# EAGLE schematic shieldV0ben (EAGLE 8.7.1)

## Sheet 1 of 6
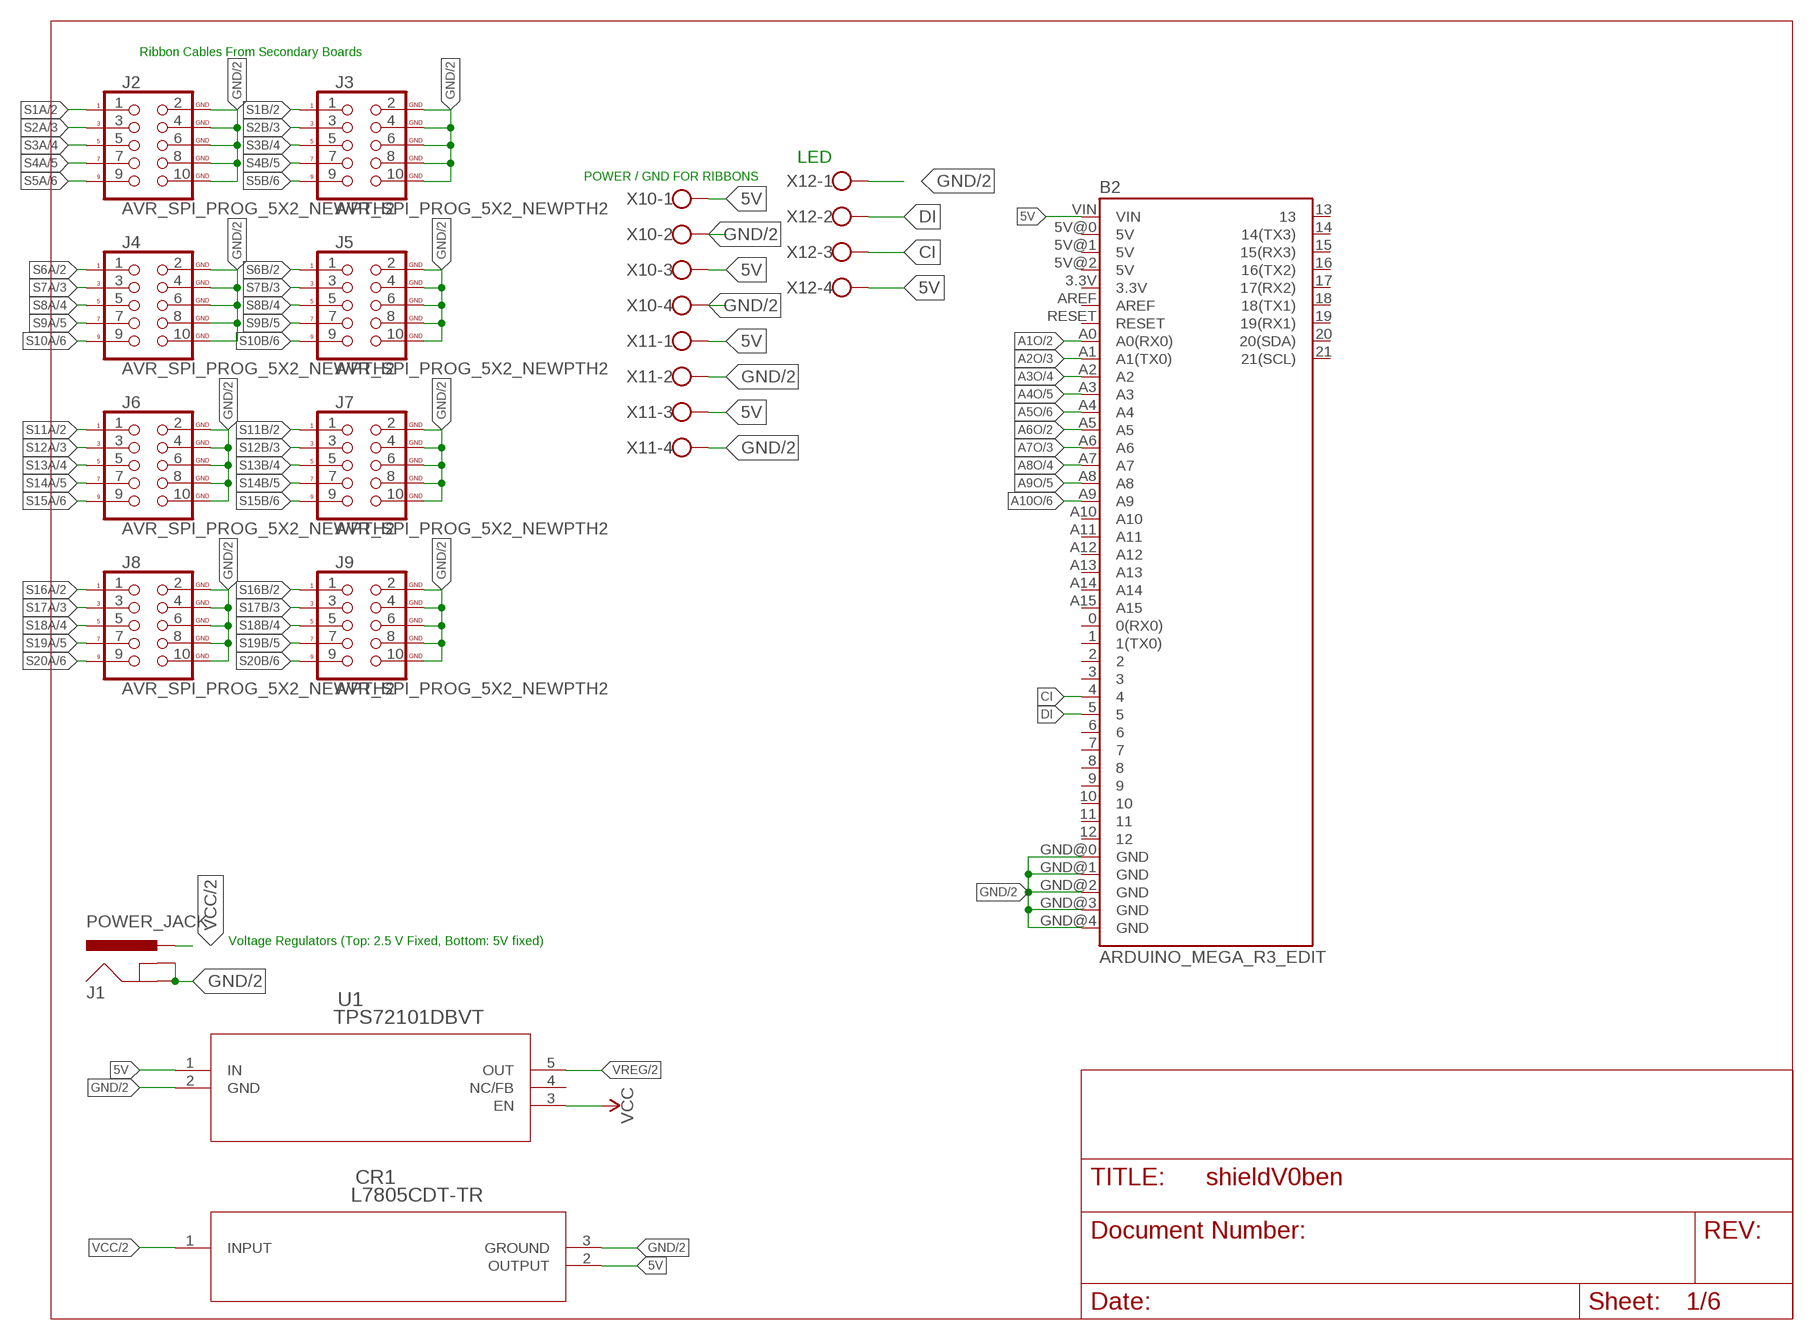
[diagram p0: schematic, sheet 1]

### Parts
B2  ARDUINO_MEGA_R3_EDIT  [ARDUINO_MEGA_EDIT]
CR1  L7805CDT-TR  [DPAK]
J1  POWER_JACK  [POWER_JACK_PTH]
J2  AVR_SPI_PROG_5X2_NEWPTH2  [2X5-SHROUDED]
J3  AVR_SPI_PROG_5X2_NEWPTH2  [2X5-SHROUDED]
J4  AVR_SPI_PROG_5X2_NEWPTH2  [2X5-SHROUDED]
J5  AVR_SPI_PROG_5X2_NEWPTH2  [2X5-SHROUDED]
J6  AVR_SPI_PROG_5X2_NEWPTH2  [2X5-SHROUDED]
J7  AVR_SPI_PROG_5X2_NEWPTH2  [2X5-SHROUDED]
J8  AVR_SPI_PROG_5X2_NEWPTH2  [2X5-SHROUDED]
J9  AVR_SPI_PROG_5X2_NEWPTH2  [2X5-SHROUDED]
U1  TPS72101DBVT  [DBV5]
X10  W237-4  [W237-4]
X11  W237-4  [W237-4]
X12  W237-4  [W237-4]

### Nets
5V: B2.VIN CR1.2(OUTPUT) U1.1(IN) X10.1 X10.3 X11.1 X11.3 X12.4
A1O: B2.A0(A0(RX0)) ; also sheet 2
A2O: B2.A1(A1(TX0)) ; also sheet 3
A3O: B2.A2 ; also sheet 4
A4O: B2.A3 ; also sheet 5
A5O: B2.A4 ; also sheet 6
A6O: B2.A5 ; also sheet 2
A7O: B2.A6 ; also sheet 3
A8O: B2.A7 ; also sheet 4
A9O: B2.A8 ; also sheet 5
A10O: B2.A9 ; also sheet 6
CI: B2.4 X12.3
DI: B2.5 X12.2
GND: B2.GND@0(GND) B2.GND@1(GND) B2.GND@2(GND) B2.GND@3(GND) B2.GND@4(GND) CR1.3(GROUND) J1.GND J1.GNDBREAK J2.2(GND) J2.4(GND) J2.6(GND) J2.8(GND) J2.10(GND) J3.2(GND) J3.4(GND) J3.6(GND) J3.8(GND) J3.10(GND) J4.2(GND) J4.4(GND) J4.6(GND) J4.8(GND) J4.10(GND) J5.2(GND) J5.4(GND) J5.6(GND) J5.8(GND) J5.10(GND) J6.2(GND) J6.4(GND) J6.6(GND) J6.8(GND) J6.10(GND) J7.2(GND) J7.4(GND) J7.6(GND) J7.8(GND) J7.10(GND) J8.2(GND) J8.4(GND) J8.6(GND) J8.8(GND) J8.10(GND) J9.2(GND) J9.4(GND) J9.6(GND) J9.8(GND) J9.10(GND) U1.2(GND) X10.2 X10.4 X11.2 X11.4 X12.1 ; also sheet 2,3,4,5,6
S1A: J2.1 ; also sheet 2
S1B: J3.1 ; also sheet 2
S2A: J2.3 ; also sheet 3
S2B: J3.3 ; also sheet 3
S3A: J2.5 ; also sheet 4
S3B: J3.5 ; also sheet 4
S4A: J2.7 ; also sheet 5
S4B: J3.7 ; also sheet 5
S5A: J2.9 ; also sheet 6
S5B: J3.9 ; also sheet 6
S6A: J4.1 ; also sheet 2
S6B: J5.1 ; also sheet 2
S7A: J4.3 ; also sheet 3
S7B: J5.3 ; also sheet 3
S8A: J4.5 ; also sheet 4
S8B: J5.5 ; also sheet 4
S9A: J4.7 ; also sheet 5
S9B: J5.7 ; also sheet 5
S10A: J4.9 ; also sheet 6
S10B: J5.9 ; also sheet 6
S11A: J6.1 ; also sheet 2
S11B: J7.1 ; also sheet 2
S12A: J6.3 ; also sheet 3
S12B: J7.3 ; also sheet 3
S13A: J6.5 ; also sheet 4
S13B: J7.5 ; also sheet 4
S14A: J6.7 ; also sheet 5
S14B: J7.7 ; also sheet 5
S15A: J6.9 ; also sheet 6
S15B: J7.9 ; also sheet 6
S16A: J8.1 ; also sheet 2
S16B: J9.1 ; also sheet 2
S17A: J8.3 ; also sheet 3
S17B: J9.3 ; also sheet 3
S18A: J8.5 ; also sheet 4
S18B: J9.5 ; also sheet 4
S19A: J8.7 ; also sheet 5
S19B: J9.7 ; also sheet 5
S20A: J8.9 ; also sheet 6
S20B: J9.9 ; also sheet 6
VCC: CR1.1(INPUT) J1.PWR U1.3(EN) ; also sheet 2,3,4,5,6
VREG: U1.5(OUT) ; also sheet 2,3,4,5,6
Unconnected: B2.0(0(RX0)) B2.1(1(TX0)) B2.2 B2.3 B2.3.3V B2.5V@0(5V) B2.5V@1(5V) B2.5V@2(5V) B2.6 B2.7 B2.8 B2.9 B2.10 B2.11 B2.12 B2.13 B2.14(14(TX3)) B2.15(15(RX3)) B2.16(16(TX2)) B2.17(17(RX2)) B2.18(18(TX1)) B2.19(19(RX1)) B2.20(20(SDA)) B2.21(21(SCL)) B2.A10 B2.A11 B2.A12 B2.A13 B2.A14 B2.A15 B2.AREF B2.RESET U1.4(NC/FB)

### Notes on the sheet
- Ribbon Cables From Secondary Boards
- LED
- POWER / GND FOR RIBBONS
- Voltage Regulators (Top: 2.5 V Fixed, Bottom: 5V fixed)

## Sheet 2 of 6
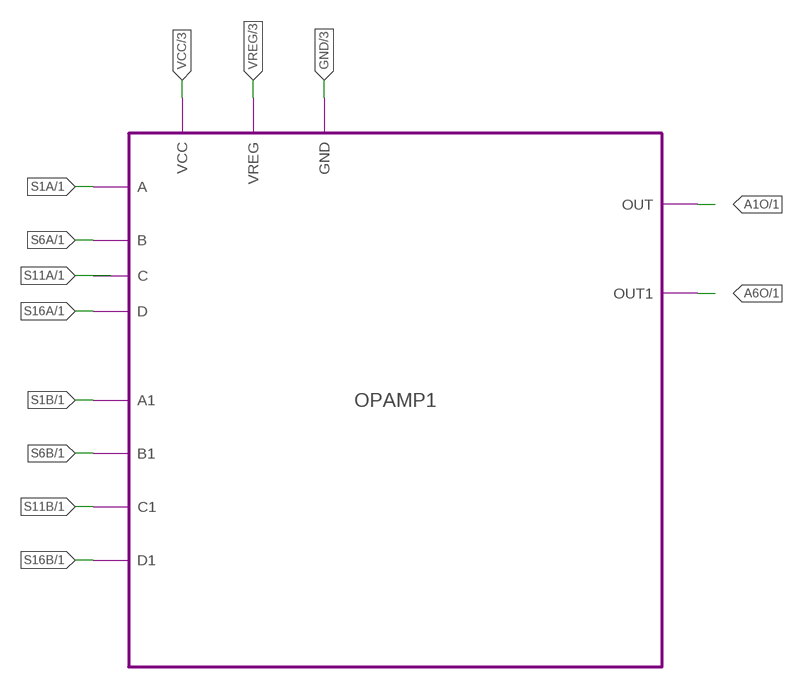
[diagram p1: schematic, sheet 2]

### Module instances
OPAMP1 = OPAMP

### Nets
A1O: port OPAMP1.OUT ; also sheet 1
A6O: port OPAMP1.OUT1 ; also sheet 1
GND: port OPAMP1.GND ; also sheet 1,3,4,5,6
S1A: port OPAMP1.A ; also sheet 1
S1B: port OPAMP1.A1 ; also sheet 1
S6A: port OPAMP1.B ; also sheet 1
S6B: port OPAMP1.B1 ; also sheet 1
S11B: port OPAMP1.C1 ; also sheet 1
S16A: port OPAMP1.D ; also sheet 1
S16B: port OPAMP1.D1 ; also sheet 1
VCC: port OPAMP1.VCC ; also sheet 1,3,4,5,6
VREG: port OPAMP1.VREG ; also sheet 1,3,4,5,6

## Sheet 3 of 6
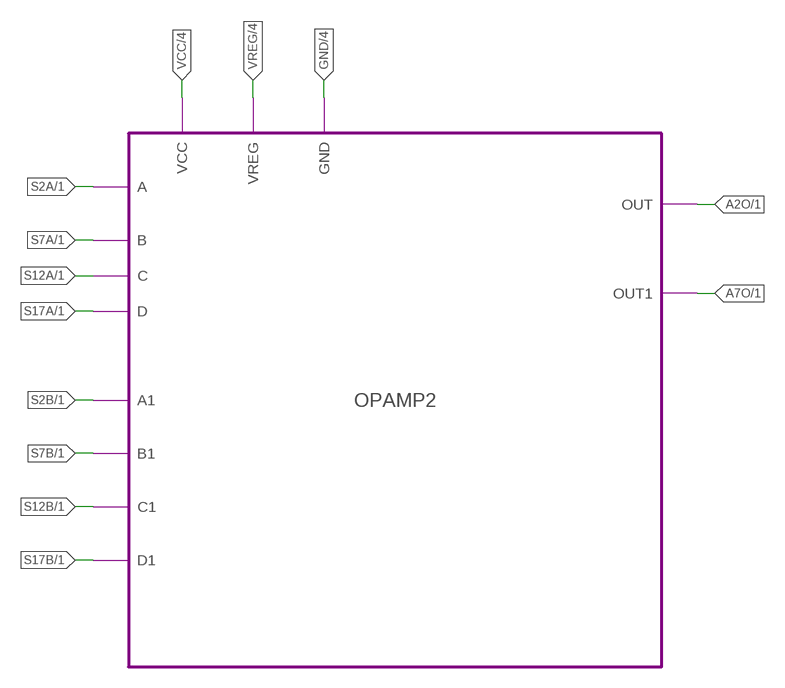
[diagram p2: schematic, sheet 3]

### Module instances
OPAMP2 = OPAMP

### Nets
A2O: port OPAMP2.OUT ; also sheet 1
A7O: port OPAMP2.OUT1 ; also sheet 1
GND: port OPAMP2.GND ; also sheet 1,2,4,5,6
S2A: port OPAMP2.A ; also sheet 1
S2B: port OPAMP2.A1 ; also sheet 1
S7A: port OPAMP2.B ; also sheet 1
S7B: port OPAMP2.B1 ; also sheet 1
S12A: port OPAMP2.C ; also sheet 1
S12B: port OPAMP2.C1 ; also sheet 1
S17A: port OPAMP2.D ; also sheet 1
S17B: port OPAMP2.D1 ; also sheet 1
VCC: port OPAMP2.VCC ; also sheet 1,2,4,5,6
VREG: port OPAMP2.VREG ; also sheet 1,2,4,5,6

## Sheet 4 of 6
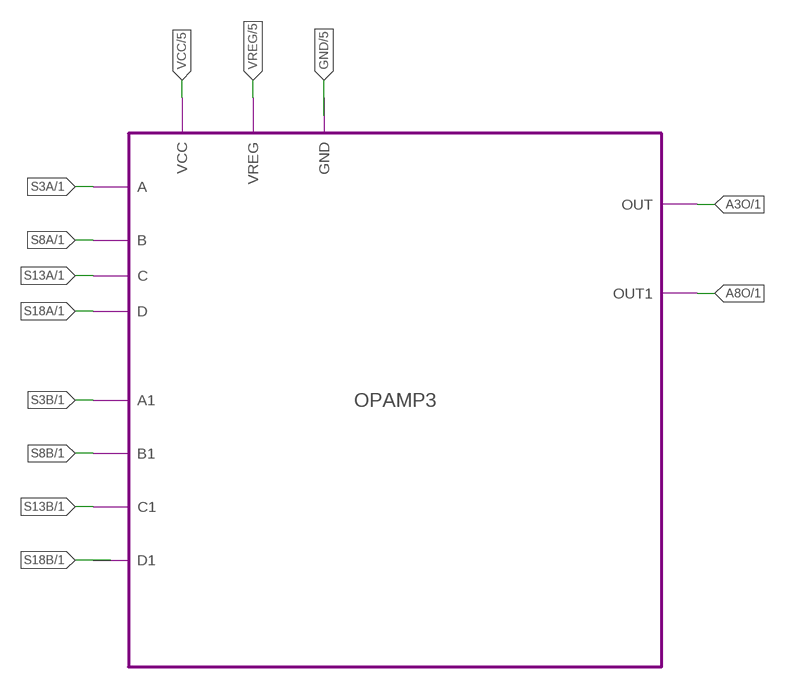
[diagram p3: schematic, sheet 4]

### Module instances
OPAMP3 = OPAMP

### Nets
A3O: port OPAMP3.OUT ; also sheet 1
A8O: port OPAMP3.OUT1 ; also sheet 1
S3A: port OPAMP3.A ; also sheet 1
S3B: port OPAMP3.A1 ; also sheet 1
S8A: port OPAMP3.B ; also sheet 1
S8B: port OPAMP3.B1 ; also sheet 1
S13A: port OPAMP3.C ; also sheet 1
S13B: port OPAMP3.C1 ; also sheet 1
S18A: port OPAMP3.D ; also sheet 1
VCC: port OPAMP3.VCC ; also sheet 1,2,3,5,6
VREG: port OPAMP3.VREG ; also sheet 1,2,3,5,6

## Sheet 5 of 6
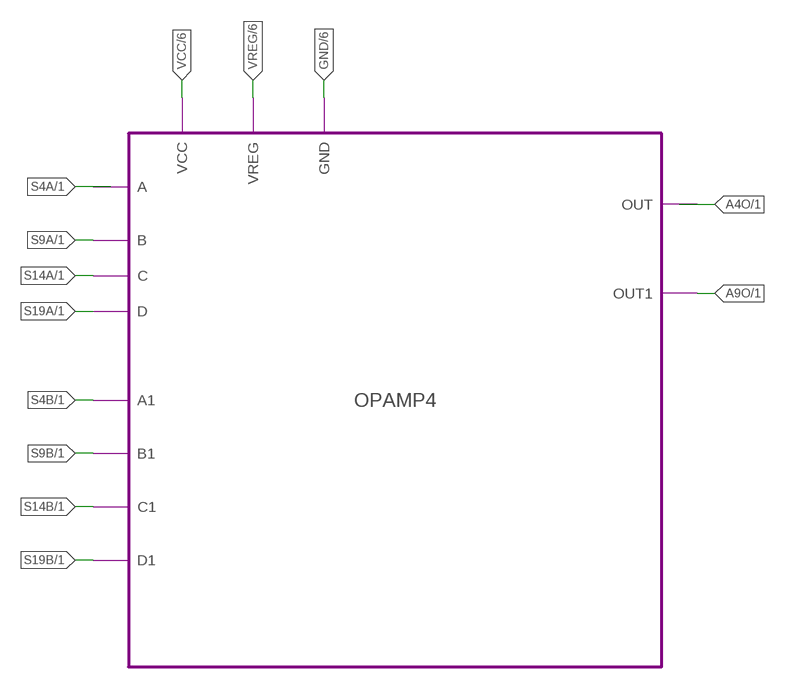
[diagram p4: schematic, sheet 5]

### Module instances
OPAMP4 = OPAMP

### Nets
A9O: port OPAMP4.OUT1 ; also sheet 1
GND: port OPAMP4.GND ; also sheet 1,2,3,4,6
S4B: port OPAMP4.A1 ; also sheet 1
S9A: port OPAMP4.B ; also sheet 1
S9B: port OPAMP4.B1 ; also sheet 1
S14A: port OPAMP4.C ; also sheet 1
S14B: port OPAMP4.C1 ; also sheet 1
S19A: port OPAMP4.D ; also sheet 1
S19B: port OPAMP4.D1 ; also sheet 1
VCC: port OPAMP4.VCC ; also sheet 1,2,3,4,6
VREG: port OPAMP4.VREG ; also sheet 1,2,3,4,6

## Sheet 6 of 6
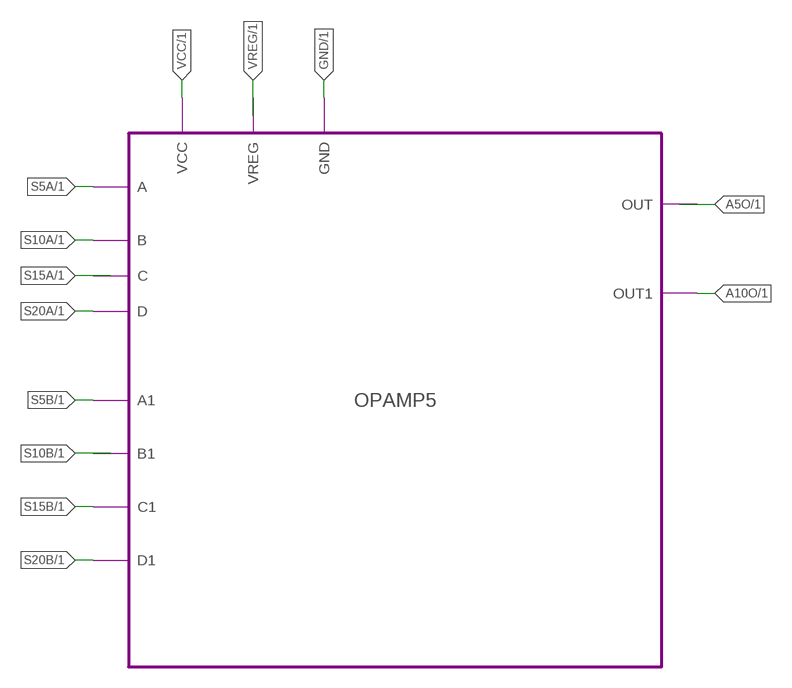
[diagram p5: schematic, sheet 6]

### Module instances
OPAMP5 = OPAMP

### Nets
A10O: port OPAMP5.OUT1 ; also sheet 1
GND: port OPAMP5.GND ; also sheet 1,2,3,4,5
S5A: port OPAMP5.A ; also sheet 1
S5B: port OPAMP5.A1 ; also sheet 1
S10A: port OPAMP5.B ; also sheet 1
S15B: port OPAMP5.C1 ; also sheet 1
S20A: port OPAMP5.D ; also sheet 1
S20B: port OPAMP5.D1 ; also sheet 1
VCC: port OPAMP5.VCC ; also sheet 1,2,3,4,5

## Library data of the parts
B2 = SparkFun-Boards:ARDUINO_MEGA_R3_EDIT: Arduino Mega R3 ATmega2560 R3 compatible footprint. SparkFun Products: Arduino Mega 2560 R3 <https://www.sparkfun.com/products/11061>
CR1 = L7805:L7805CDT-TR; MANUFACTURER_PART_NUMBER: L7805CDTTR; VENDOR: STMicroelectronics
J1 = SparkFun-Connectors:POWER_JACK: Power Jack Connector This is the standard 5.5mm barrel jack for power. The PTH is the most common, proven, reliable, footprint. The Slot footprint only works if the mill layer is transmitted to the PCB fab house so be warned. Here are the connectors we sell at SparkFun: DC Barrel Power Jack/Connector <https://www.sparkfun.com/products/119> (PRT-00119) DC Barrel Power Jack/Connector (SMD) <https://www.sparkfun.com/products/12748> (PRT-12748) DC Barrel Jack Adapter - Breadboard Compatible <https://www.sparkfun.com/products/10811> (PRT-10811) It is used on this SparkFun product (and many, many others): SparkFun RedBoard - Programmed with Arduino <https://www.sparkfun.com/products/12757> (DEV-12757) Also, if you need a mating power supply or connector, please check these out: Wall Adapter Power Supply - 9VDC 650mA <https://www.sparkfun.com/products/298> (TOL-00298) DC Barrel Jack Adapter - Male <https://www.sparkfun.com/products/10287> (PRT-10287); PROD_ID: CONN-08197
J2-J9 = SparkFun-Connectors:AVR_SPI_PROG_5X2_NEW: AVR 10-pin ICSP Header This is the standard AVR In Circuit Serial Programming header. Minimal, but includes pin one indicator. Works with standard Olimex programmers. SparkFun Products: 2x5 AVR ICSP Male Header <https://www.sparkfun.com/products/778> - PTH 2x5 Pin Shrouded Header <https://www.sparkfun.com/products/8506> - PTH2; PROD_ID: CONN-08671; SF_ID: PRT-08506
U1 = TPS72101DBVT:TPS72101DBVT; MANUFACTURER_PART_NUMBER: TPS72101DBVT; VENDOR: Texas Instruments
X10-X12 = con-wago-500:W237-4: WAGO SCREW CLAMP; OC_FARNELL: unknown; OC_NEWARK: unknown

## Module OPAMP
Ports: A(io) B(io) C(io) D(io) A1(io) B1(io) C1(io) D1(io) VCC(io) VREG(io) GND(io) OUT(io) OUT1(io)
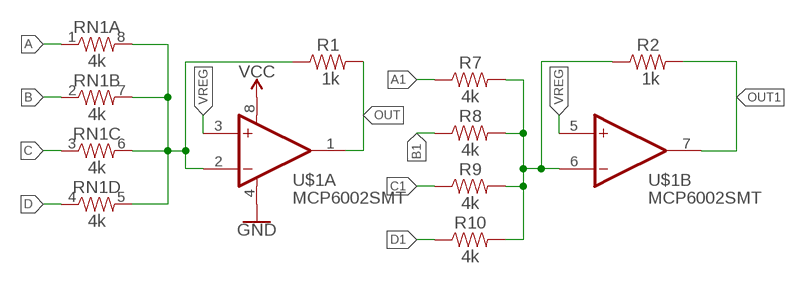
[diagram p6: schematic, module OPAMP, sheet 1]

### Parts
R1  1k  RESISTOR0805  [0805]
R2  1k  RESISTOR0805  [0805]
R7  4k  RESISTOR0805-4K  [0805-4K]
R8  4k  RESISTOR0805-4K  [0805-4K]
R9  4k  RESISTOR0805-4K  [0805-4K]
R10  4k  RESISTOR0805-4K  [0805-4K]
RN1  4k  1KOHM-ARRAY(4)0805-ARV_EDIT  [0805-ARV_EDIT]
U$1  MCP6002SMT  [SOIC8]

### Nets
A: RN1.1
A1: R7.1
B: RN1.2
B1: R8.1
C: RN1.3
C1: R9.1
D: RN1.4
D1: R10.1
GND: U$1.4(A:V-)
N$1: R1.1 RN1.5 RN1.6 RN1.7 RN1.8 U$1.2(A:-IN)
N$4: R2.1 R7.2 R8.2 R9.2 R10.2 U$1.6(B:-IN)
OUT: R1.2 U$1.1(A:OUT)
OUT1: R2.2 U$1.7(B:OUT)
VCC: U$1.8(A:V+)
VREG: U$1.3(A:+IN) U$1.5(B:+IN)

### Library data of the parts
R1 R2 R7-R10 = SparkFun-Resistors:RESISTOR: Generic Resistor Package
RN1 = SparkFun-Resistors:1KOHM-ARRAY(4): 4 x 1kΩ resistor array A resistor is a passive two-terminal electrical component that implements electrical resistance as a circuit element. Resistors act to reduce current flow, and, at the same time, act to lower voltage levels within circuits. - Wikipedia An array is a collection of discrete resistors in a single package.
U$1 = adam - ics:MCP6002: Dual General Op Amp 1.8V min supply 1MHz (6V/us)